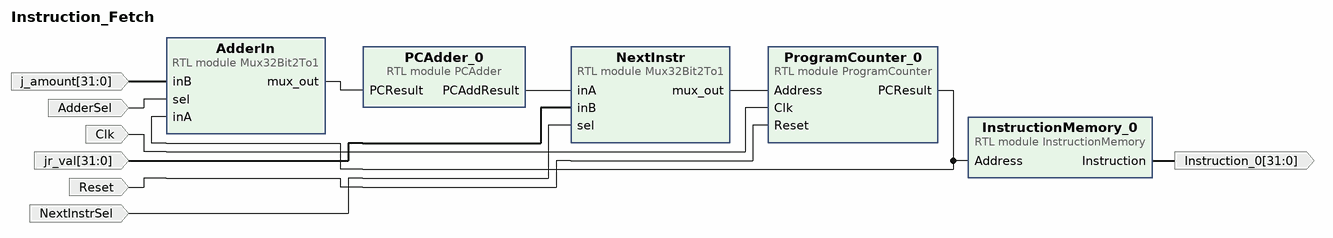
[diagram p0: block diagram of the top level]
# Vivado block design Instruction_Fetch, xc7k70tfbv676-1, Vivado 2020.2
create_bd_design Instruction_Fetch

create_bd_port -dir I AdderSel
create_bd_port -dir I -type clk Clk
create_bd_port -dir O -from 31 -to 0 Instruction_0
create_bd_port -dir I NextInstrSel
create_bd_port -dir I -type rst Reset
create_bd_port -dir I -from 31 -to 0 j_amount
create_bd_port -dir I -from 31 -to 0 jr_val

create_bd_cell -type module -reference InstructionMemory InstructionMemory_0
create_bd_cell -type module -reference PCAdder PCAdder_0
create_bd_cell -type module -reference ProgramCounter ProgramCounter_0
create_bd_cell -type module -reference Mux32Bit2To1 AdderIn
create_bd_cell -type module -reference Mux32Bit2To1 NextInstr

# ---- connections ----

connect_bd_net -net Clk_0_1 [get_bd_ports Clk] [get_bd_pins ProgramCounter_0/Clk]
connect_bd_net [get_bd_pins InstructionMemory_0/Instruction] [get_bd_ports Instruction_0]
connect_bd_net -net Mux32Bit2To1_0_out [get_bd_pins AdderIn/mux_out] [get_bd_pins PCAdder_0/PCResult]
connect_bd_net -net Mux32Bit2To1_1_out [get_bd_pins NextInstr/mux_out] [get_bd_pins ProgramCounter_0/Address]
connect_bd_net [get_bd_pins PCAdder_0/PCAddResult] [get_bd_pins NextInstr/inA]
connect_bd_net [get_bd_pins ProgramCounter_0/PCResult] [get_bd_pins InstructionMemory_0/Address] [get_bd_pins AdderIn/inA]
connect_bd_net -net Reset_0_1 [get_bd_ports Reset] [get_bd_pins ProgramCounter_0/Reset]
connect_bd_net -net inB_0_1 [get_bd_ports jr_val] [get_bd_pins NextInstr/inB]
connect_bd_net -net inB_0_2 [get_bd_ports j_amount] [get_bd_pins AdderIn/inB]
connect_bd_net -net sel_0_1 [get_bd_ports AdderSel] [get_bd_pins AdderIn/sel]
connect_bd_net -net sel_0_2 [get_bd_ports NextInstrSel] [get_bd_pins NextInstr/sel]

validate_bd_design
save_bd_design
